# Altium schematic sheet Sheet1.SchDoc
size A4
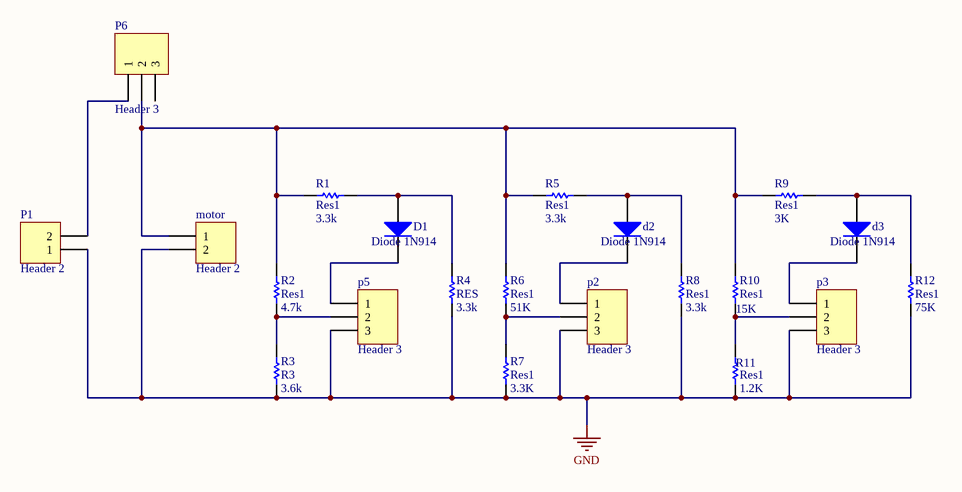
[diagram p0: Sheet1.SchDoc]

## Parts
D1  Diode 1N914  [CAPR5-4X5]
d2  Diode 1N914  [CAPR5-4X5]
d3  Diode 1N914  [CAPR5-4X5]
motor  Header 2  [POH_V3]
P1  Header 2  [POH_V3]
p2  Header 3  [HDR1X3]
p3  Header 3  [HDR1X3]
p5  Header 3  [HDR1X3]
P6  Header 3  [TO-220-AB]
R1  Res1  value 3.3k  [AXIAL-0.4]
R2  Res1  value 4.7k  [AXIAL-0.4]
R3  R3  value 3.6k  [AXIAL-0.4]
R4  RES  value 3.3k  [AXIAL-0.4]
R5  Res1  value 3.3k  [AXIAL-0.4]
R6  Res1  value 51K  [AXIAL-0.4]
R7  Res1  value 3.3K  [AXIAL-0.4]
R8  Res1  value 3.3k  [AXIAL-0.4]
R9  Res1  value 3K  [AXIAL-0.4]
R10  Res1  value 15K  [AXIAL-0.4]
R11  Res1  value 1.2K  [AXIAL-0.4]
R12  Res1  value 75K  [AXIAL-0.4]

## Nets
GND: motor.2 P1.1 p2.3 p3.3 p5.3 R3.1 R4.1 R7.1 R8.1 R11.1 R12.1
NetD1_1: D1.1(A) R1.2 R4.2
NetD1_2: D1.2(K) p5.1
Netd2_1: d2.1(A) R5.2 R8.2
Netd2_2: d2.2(K) p2.1
Netd3_1: d3.1(A) R9.2 R12.2
Netd3_2: d3.2(K) p3.1
Netmotor_1: motor.1 P6.2 R1.1 R2.2 R5.1 R6.2 R9.1 R10.2
NetP1_2: P1.2 P6.1
Netp2_2: p2.2 R6.1 R7.2
Netp3_2: p3.2 R10.1 R11.2
Netp5_2: p5.2 R2.1 R3.2

Not connected (* = marked no-connect by the designer): P6 3

## Library data of the parts
D1 d2 d3 = Diode 1N914: High Conductance Fast Diode; Published: 8-Jun-2000; LatestRevisionDate: 17-Jul-2002; LatestRevisionNote: Re-released for DXP Platform.; DatasheetVersion: 1997; PackageReference: DO-35; Publisher: Altium Limited; PackageDescription: Diode, Axial; Body 3.8 x 1.9 mm (LxDia. max), Lead Dia. 0.53 mm (max); Code_JEDEC: DO-204-AH; ComponentLink1Description: Manufacturer Link; ComponentLink1URL: http://www.fairchildsemi.com/; ComponentLink2Description: Datasheet; ComponentLink2URL: http://www.fairchildsemi.com/ds/1N%2F1N4448.pdf
motor P1 = Header 2: Header, 2-Pin; LatestRevisionDate: 17-Jul-2002; LatestRevisionNote: Re-released for DXP Platform.; Publisher: Altium Limited
p2 p3 p5 P6 = Header 3: Header, 3-Pin; LatestRevisionDate: 17-Jul-2002; LatestRevisionNote: Re-released for DXP Platform.; Publisher: Altium Limited
R1-R12 = Res1: Resistor; Published: 8-Jun-2000; LatestRevisionDate: 17-Jul-2002; LatestRevisionNote: Re-released for DXP Platform.; PackageReference: AXIAL-0.3; Publisher: Altium Limited; PackageDescription: Axial Device, Thru-Hole; 2 Leads; 0.3 in Pin Spacing